# Altium schematic sheet sptReg.SCHDOC: LiveDesign Evaluation - Video Games
size A; Organization: Altium Limited; Address1: L3, 12a Rodborough Rd; Address2: Frenchs Forest; Address3: NSW; Address4: Australia 2086; DocumentNumber: 4; SheetNumber: 4; SheetTotal: 13
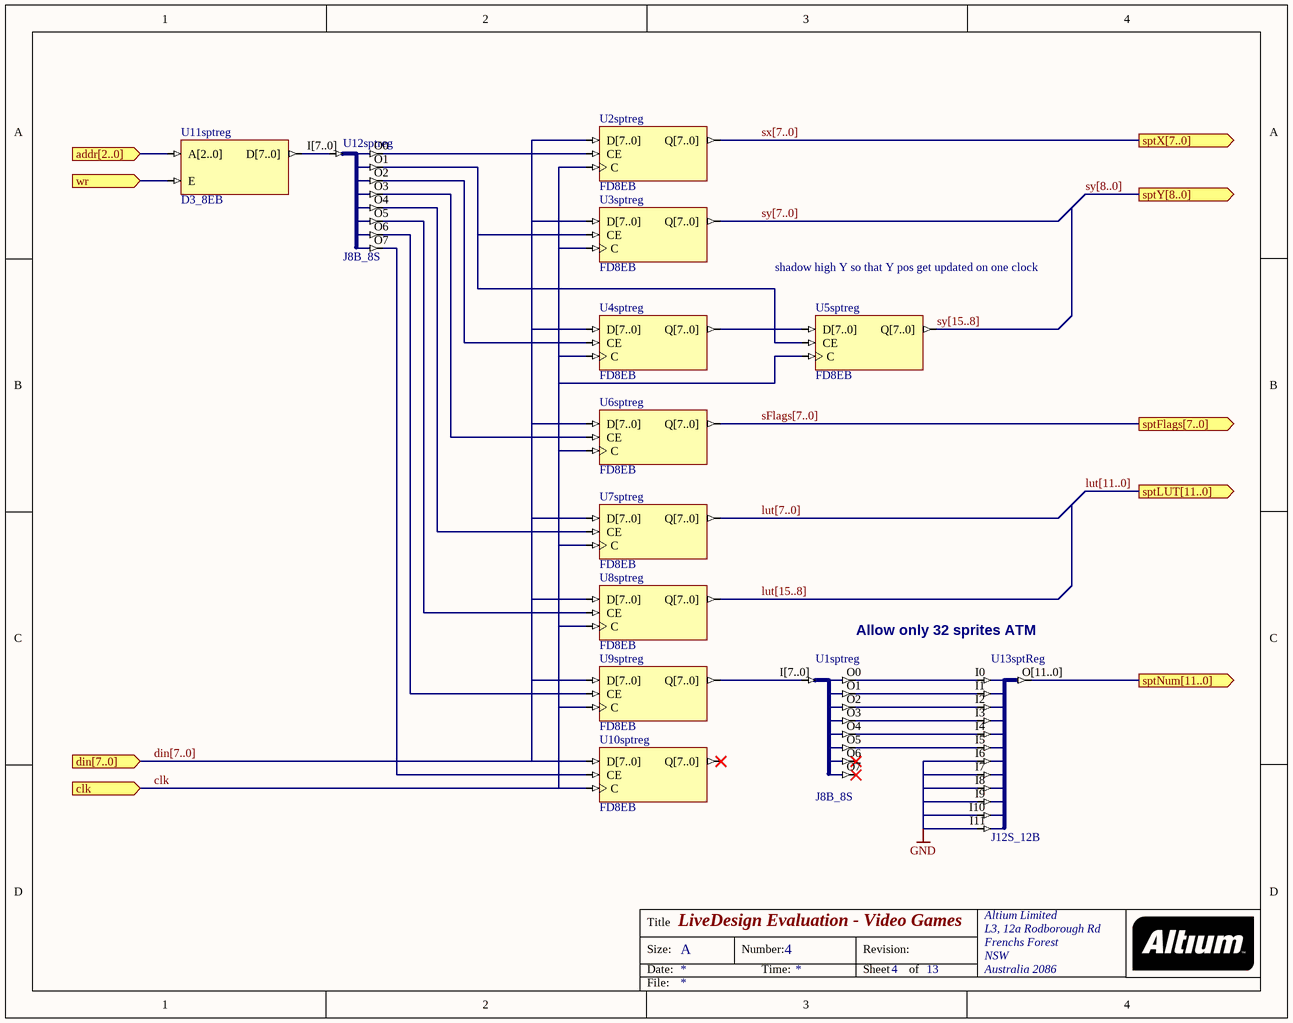
[diagram p0: sptReg.SCHDOC]

## Parts
U1sptreg  J8B_8S
U2sptreg  FD8EB
U3sptreg  FD8EB
U4sptreg  FD8EB
U5sptreg  FD8EB
U6sptreg  FD8EB
U7sptreg  FD8EB
U8sptreg  FD8EB
U9sptreg  FD8EB
U10sptreg  FD8EB
U11sptreg  D3_8EB
U12sptreg  J8B_8S
U13sptReg  J12S_12B

## Ports
addr[2..0] (in), clk (in), din[7..0] (in), sptFlags[7..0] (out), sptLUT[11..0] (out), sptNum[11..0] (out), sptX[7..0] (out), sptY[8..0] (out), wr (in)

## Nets
GND: U13sptReg.I6 U13sptReg.I7 U13sptReg.I8 U13sptReg.I9 U13sptReg.I10 U13sptReg.I11
addr[2..0]: U11sptreg.A[2..0] ; port addr[2..0]
clk: U2sptreg.C U3sptreg.C U4sptreg.C U5sptreg.C U6sptreg.C U7sptreg.C U8sptreg.C U9sptreg.C U10sptreg.C ; port clk
din[7..0]: U2sptreg.D[7..0] U3sptreg.D[7..0] U4sptreg.D[7..0] U6sptreg.D[7..0] U7sptreg.D[7..0] U8sptreg.D[7..0] U9sptreg.D[7..0] U10sptreg.D[7..0] ; port din[7..0]
lut[7..0]: U7sptreg.Q[7..0]
lut[15..8]: U8sptreg.Q[7..0]
sFlags[7..0]: U6sptreg.Q[7..0] ; port sptFlags[7..0]
sptNum[11..0]: U13sptReg.O[11..0] ; port sptNum[11..0]
sx[7..0]: U2sptreg.Q[7..0] ; port sptX[7..0]
sy[7..0]: U3sptreg.Q[7..0]
sy[15..8]: U5sptreg.Q[7..0]
wr: U11sptreg.E ; port wr
NetU1sptreg_I[7..0]: U1sptreg.I[7..0] U9sptreg.Q[7..0]
NetU1sptreg_O0: U1sptreg.O0 U13sptReg.I0
NetU1sptreg_O1: U1sptreg.O1 U13sptReg.I1
NetU1sptreg_O2: U1sptreg.O2 U13sptReg.I2
NetU1sptreg_O3: U1sptreg.O3 U13sptReg.I3
NetU1sptreg_O4: U1sptreg.O4 U13sptReg.I4
NetU1sptreg_O5: U1sptreg.O5 U13sptReg.I5
NetU2sptreg_CE: U2sptreg.CE U12sptreg.O0
NetU3sptreg_CE: U3sptreg.CE U5sptreg.CE U12sptreg.O1
NetU4sptreg_CE: U4sptreg.CE U12sptreg.O2
NetU4sptreg_Q[7..0]: U4sptreg.Q[7..0] U5sptreg.D[7..0]
NetU6sptreg_CE: U6sptreg.CE U12sptreg.O3
NetU7sptreg_CE: U7sptreg.CE U12sptreg.O4
NetU8sptreg_CE: U8sptreg.CE U12sptreg.O5
NetU9sptreg_CE: U9sptreg.CE U12sptreg.O6
NetU10sptreg_CE: U10sptreg.CE U12sptreg.O7
NetU11sptreg_D[7..0]: U11sptreg.D[7..0] U12sptreg.I[7..0]

Not connected (* = marked no-connect by the designer): U1sptreg O6* O7*; U10sptreg Q[7..0]*

## Buses and harness runs
bus din[7..0] = port din[7..0]
bus lut[7..0]
bus lut[11..0] = port sptLUT[11..0]
bus lut[15..8]
bus sFlags[7..0] = port sptFlags[7..0]
bus sx[7..0] = port sptX[7..0]
bus sy[7..0]
bus sy[8..0] = port sptY[8..0]
bus sy[15..8]

## Notes on the sheet
- shadow high Y so that Y pos get updated on one clock
- Allow only 32 sprites ATM
- Title
- Size:
- Date:
- A
- Number:
- Time:
- Revision:
- Sheet
- of
- File:

## Library data of the parts
U1sptreg U12sptreg = J8B_8S: 8-Bit input bus to 8 single pin outputs; ArchiveName: GENERIC; Published: 18-Dec-2003; Publisher: Altium Limited; Core Revision: 1.00.00
U2sptreg U3sptreg U4sptreg U5sptreg U6sptreg U7sptreg U8sptreg U9sptreg U10sptreg = FD8EB: 8-Bit D Flip-Flop with Clock Enable, Bus Version; ArchiveName: GENERIC; Published: 9-30-2003; Publisher: Altium Limited; Core Revision: 1.00.00
U11sptreg = D3_8EB: Binary 3- to 8-Bit Decoder with Enable, Bus Version; ArchiveName: GENERIC; Published: 9-30-2003; Publisher: Altium Limited; Core Revision: 1.00.00
U13sptReg = J12S_12B: 12 Single pin inputs to single 12-Bit output bus; ArchiveName: GENERIC; Published: 18-Dec-2003; Publisher: Altium Limited; Core Revision: 1.00.00